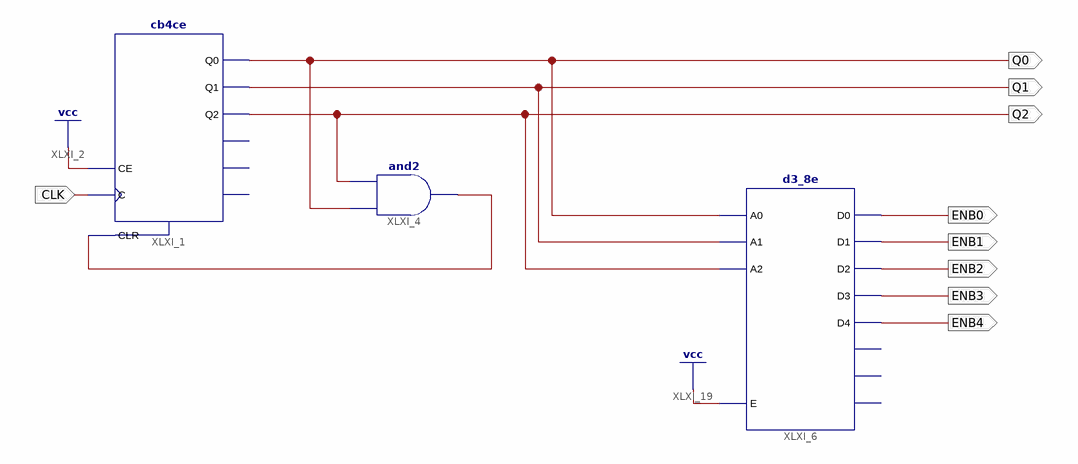
[diagram p0: schematic sheet 1]
// Xilinx ISE schematic mod5cnt.sch (spartan3) as structural Verilog: 3 symbols, 9 ports
module mod5cnt (
  input  CLK,
  output Q0,
  output Q1,
  output Q2,
  output ENB0,
  output ENB1,
  output ENB2,
  output ENB3,
  output ENB4
);

  wire XLXN_8;

  cb4ce XLXI_1 (.C(CLK), .CE(1'b1), .CLR(XLXN_8), .Q0(Q0), .Q1(Q1), .Q2(Q2));  // open: CEO, Q3, TC
  and XLXI_4 (XLXN_8, Q0, Q2);
  d3_8e XLXI_6 (
    .A0(Q0), .A1(Q1), .A2(Q2), .E(1'b1), .D0(ENB0), .D1(ENB1), .D2(ENB2), .D3(ENB3), .D4(ENB4));  // open: D5, D6, D7
endmodule
